# EAGLE design STM32F4 TFT-Proto Adapter FSMC Vertical (EAGLE 6.4)
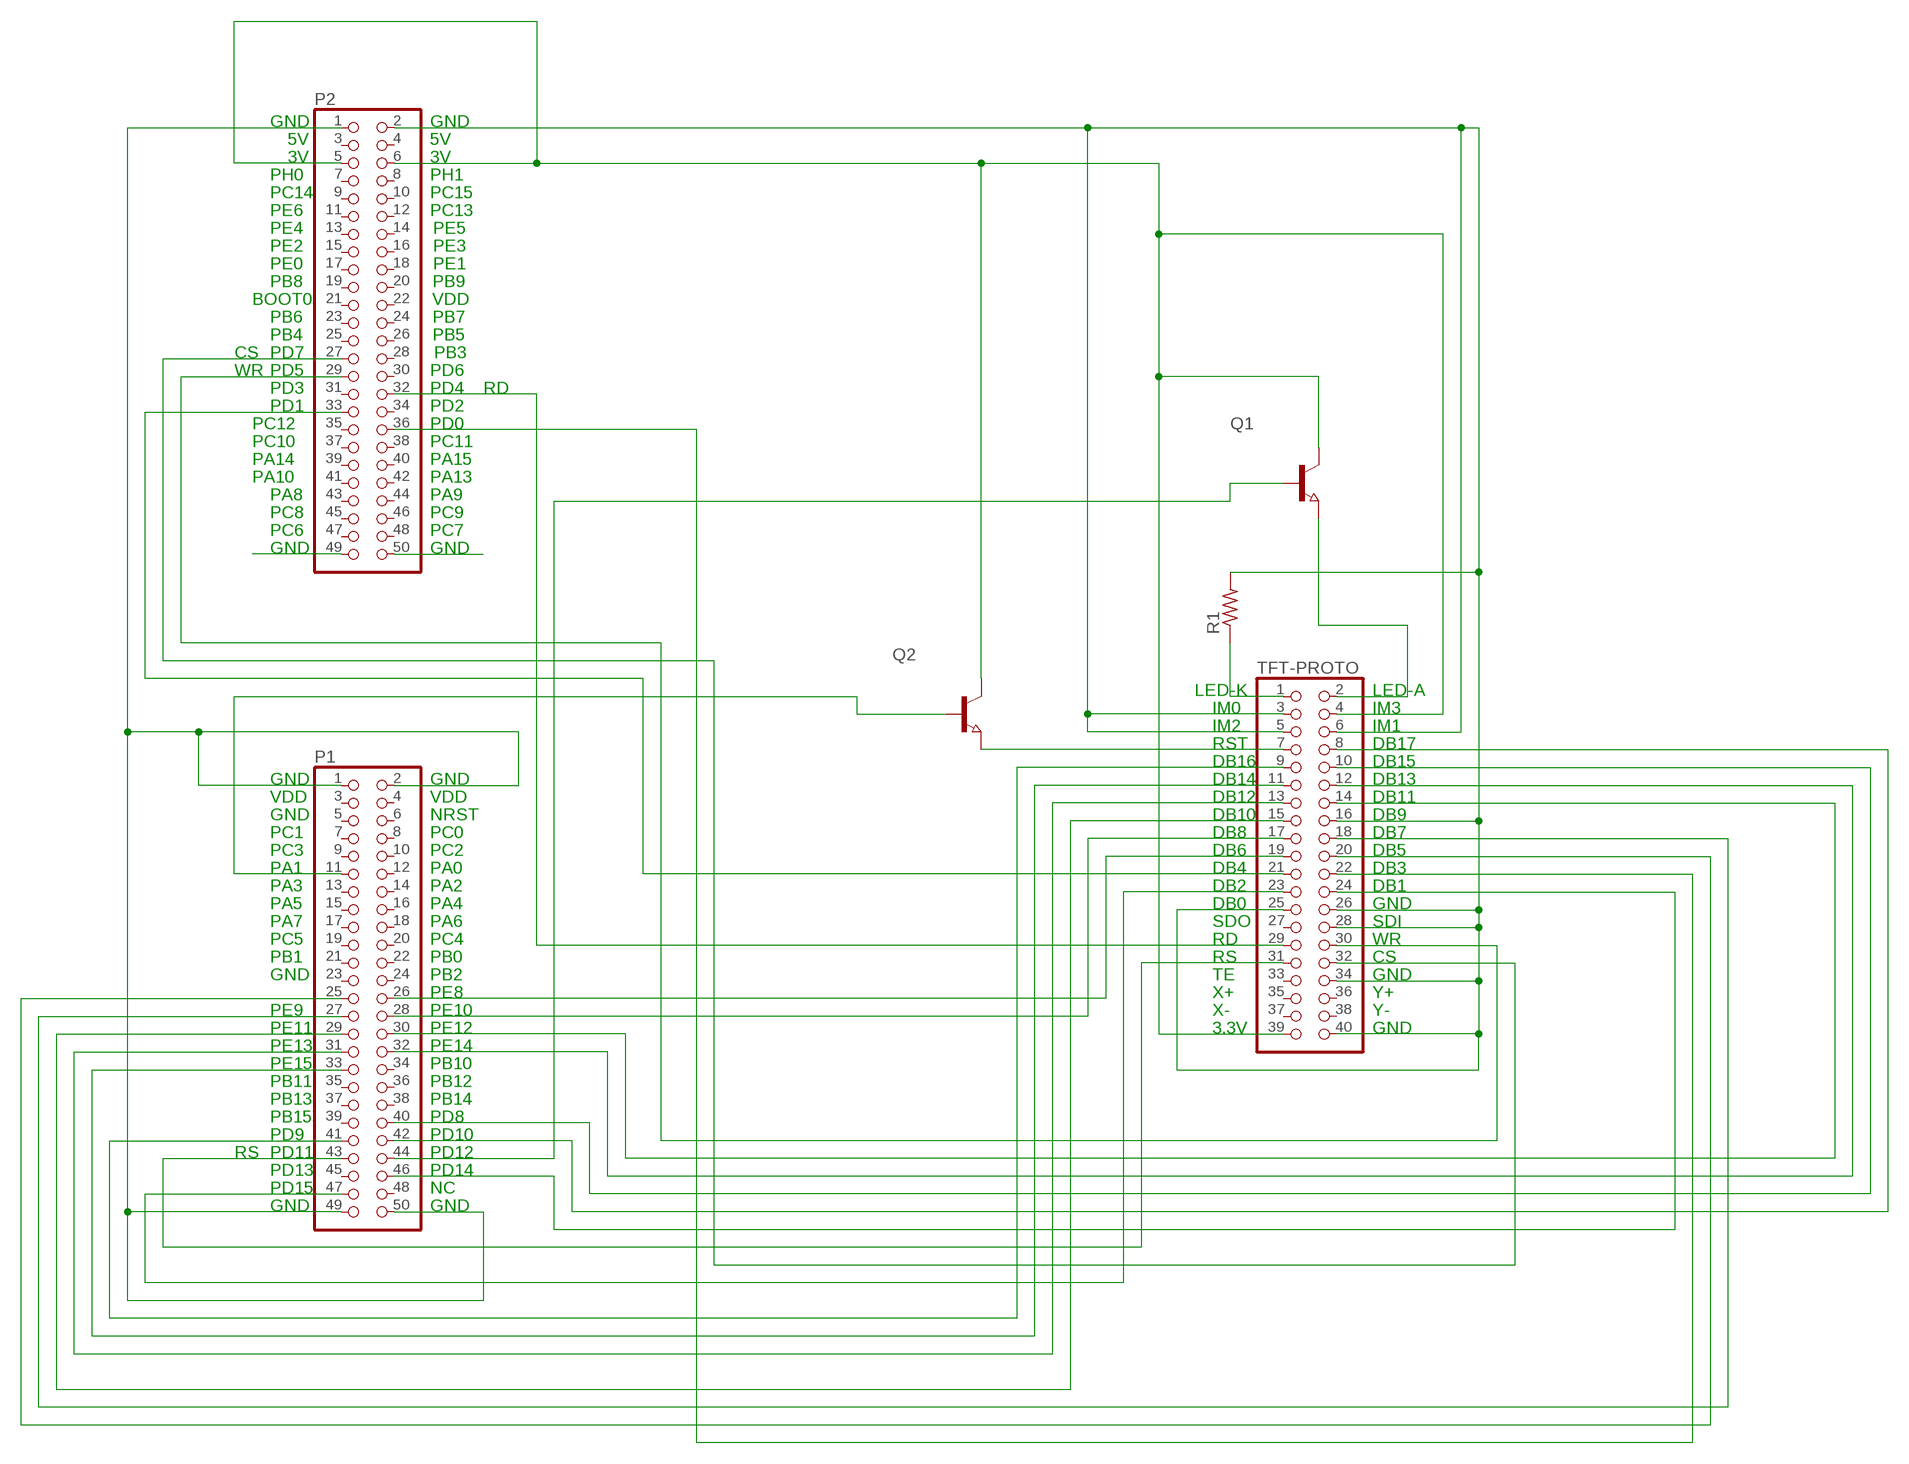
[diagram p0: schematic, sheet 1]

## Parts
P1  PINHD-2X25  [2X25]
P2  PINHD-2X25  [2X25]
Q1  NPN-TRANSISTOR_SOT23  [SOT23]
Q2  NPN-TRANSISTOR_SOT23  [SOT23]
R1  R-US_R0805  [R0805]
TFT-PROTO  PINHD-2X20  [2X20]

## Nets
CS: P2.27 TFT-PROTO.32
DB1: P1.46 TFT-PROTO.24
DB2: P1.47 TFT-PROTO.23
DB3: P2.36 TFT-PROTO.22
DB4: P2.33 TFT-PROTO.21
DB5: P1.25 TFT-PROTO.20
DB6: P1.26 TFT-PROTO.19
DB7: P1.27 TFT-PROTO.18
DB8: P1.28 TFT-PROTO.17
DB10: P1.29 TFT-PROTO.15
DB11: P1.30 TFT-PROTO.14
DB12: P1.31 TFT-PROTO.13
DB13: P1.32 TFT-PROTO.12
DB14: P1.33 TFT-PROTO.11
DB15: P1.40 TFT-PROTO.10
DB16: P1.41 TFT-PROTO.9
DB17: P1.42 TFT-PROTO.8
GND: P1.1 P1.2 P1.49 P1.50 P2.1 P2.2 P2.49 P2.50 R1.2 TFT-PROTO.3 TFT-PROTO.5 TFT-PROTO.6 TFT-PROTO.16 TFT-PROTO.25 TFT-PROTO.26 TFT-PROTO.28 TFT-PROTO.34 TFT-PROTO.40
N$1: P1.44 Q1.1(B)
N$3: R1.1 TFT-PROTO.1
N$4: Q1.2(E) TFT-PROTO.2
N$26: Q2.2(E) TFT-PROTO.7
PWR: P2.5 P2.6 Q1.3(C) Q2.3(C) TFT-PROTO.4 TFT-PROTO.39
RD: P2.32 TFT-PROTO.29
RS: P1.43 TFT-PROTO.31
RST: P1.11 Q2.1(B)
WR: P2.29 TFT-PROTO.30
Unconnected: P1.3 P1.4 P1.5 P1.6 P1.7 P1.8 P1.9 P1.10 P1.12 P1.13 P1.14 P1.15 P1.16 P1.17 P1.18 P1.19 P1.20 P1.21 P1.22 P1.23 P1.24 P1.34 P1.35 P1.36 P1.37 P1.38 P1.39 P1.45 P1.48 P2.3 P2.4 P2.7 P2.8 P2.9 P2.10 P2.11 P2.12 P2.13 P2.14 P2.15 P2.16 P2.17 P2.18 P2.19 P2.20 P2.21 P2.22 P2.23 P2.24 P2.25 P2.26 P2.28 P2.30 P2.31 P2.34 P2.35 P2.37 P2.38 P2.39 P2.40 P2.41 P2.42 P2.43 P2.44 P2.45 P2.46 P2.47 P2.48 TFT-PROTO.27 TFT-PROTO.33 TFT-PROTO.35 TFT-PROTO.36 TFT-PROTO.37 TFT-PROTO.38

## Notes on the sheet
- GND | GND
- 5V | 5V
- 3V | 3V
- PH0 | PH1
- PC14 | PC15
- PE6 | PC13
- PE4                          PE5
- PE2                          PE3
- PE0                          PE1
- PB8                          PB9
- BOOT0                        VDD
- PB6                          PB7
- PB4                          PB5
- CS | PD7                          PB3
- WR | PD5 | PD6
- PD3 | PD4 | RD
- PD1 | PD2
- PC12 | PD0
- PC10 | PC11
- PA14 | PA15
- PA10 | PA13
- PA8 | PA9
- PC8 | PC9
- PC6 | PC7
- GND | GND
- LED-K | LED-A
- IM0 | IM3
- IM2 | IM1
- RST | DB17
- DB16 | DB15
- GND | GND | DB14 | DB13
- VDD | VDD | DB12 | DB11
- GND | NRST | DB10 | DB9
- PC1 | PC0 | DB8 | DB7
- PC3 | PC2 | DB6 | DB5
- PA1 | PA0 | DB4 | DB3
- PA3 | PA2 | DB2 | DB1
- PA5 | PA4 | DB0 | GND
- PA7 | PA6 | SDO | SDI
- PC5 | PC4 | RD | WR
- PB1 | PB0 | RS | CS
- GND | PB2 | TE | GND
- PE7 | PE8 | X+ | Y+
- PE9 | PE10 | X- | Y-
- PE11 | PE12 | 3.3V | GND
- PE13 | PE14
- PE15 | PB10
- PB11 | PB12
- PB13 | PB14
- PB15 | PD8
- PD9 | PD10
- RS | PD11 | PD12
- PD13 | PD14
- PD15 | NC
- GND | GND

## Library data of the parts
P1 P2 = pinhead:PINHD-2X25: PIN HEADER
Q1 Q2 = semicon-smd-ipc:NPN-TRANSISTOR_: NPN TRANSISTOR
R1 = resistor:R-US_: RESISTOR, American symbol
TFT-PROTO = pinhead:PINHD-2X20: PIN HEADER

## Board
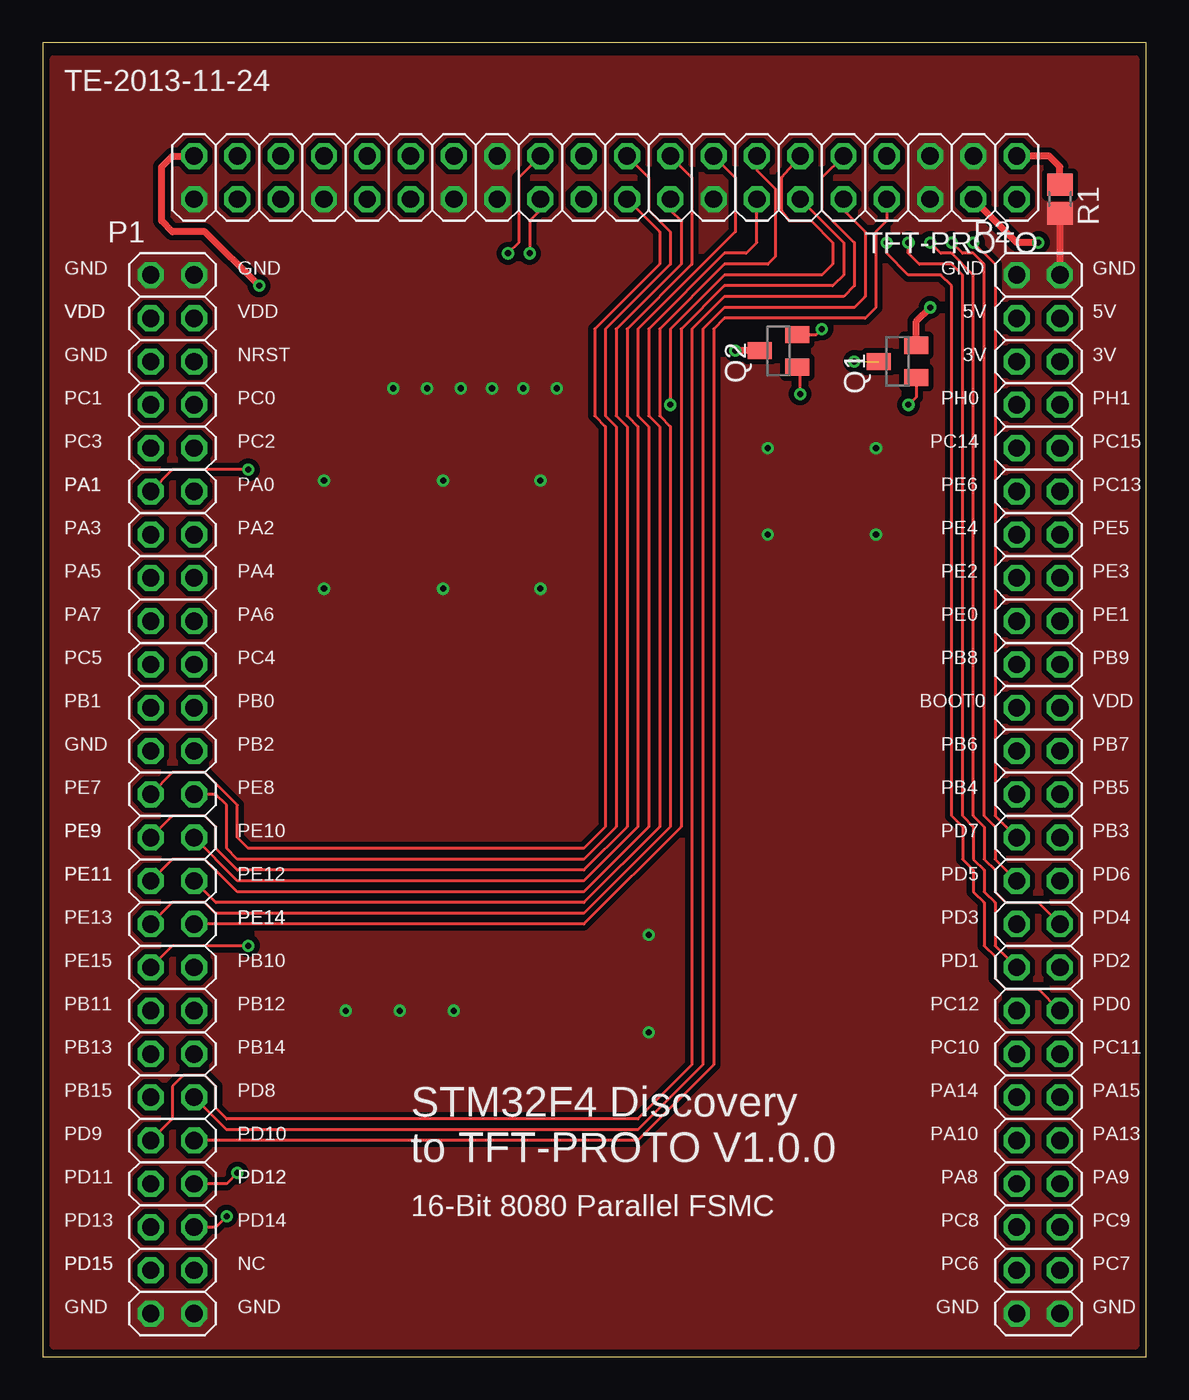
[diagram p1: board, top side]
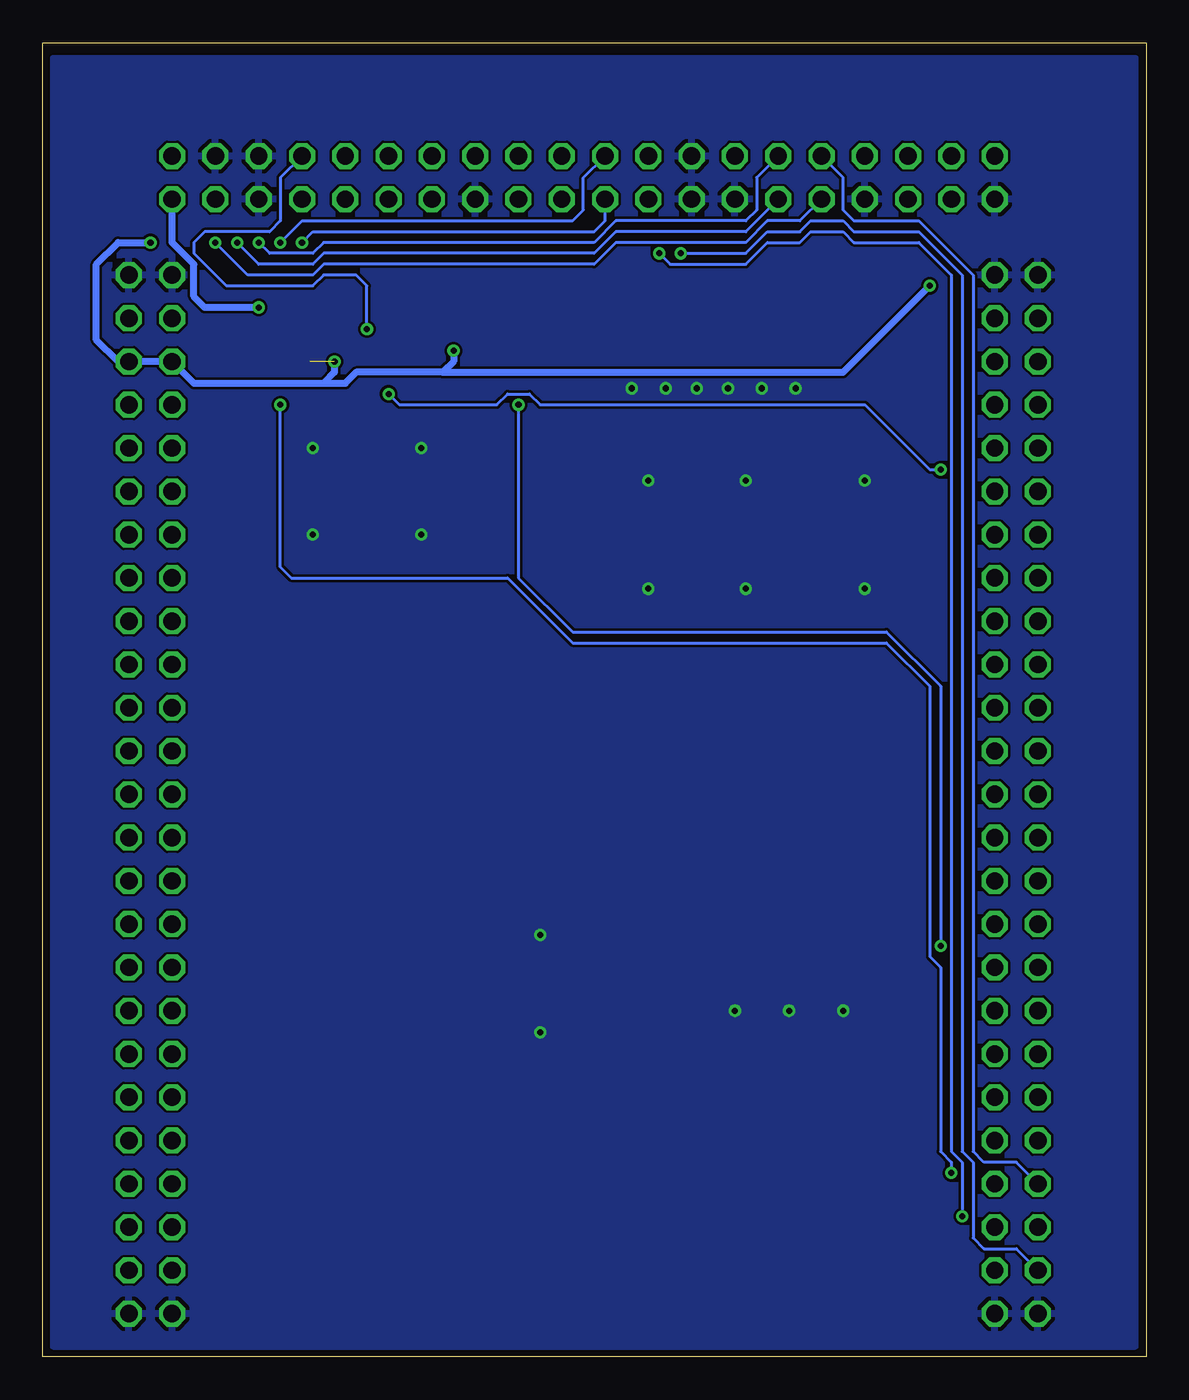
[diagram p2: board, bottom side, seen from below]

Size 64.75 x 77.14 mm. Coordinates in mm from the lower left corner, seen from the top.
Outline: 0,0 64.75,0 64.75,77.14 0,77.14 0,0
Copper layers (1*16): Top 0.0356mm / dielectric 1.5011mm / Bottom 0.0356mm
Design rules "LaenPCBOrder *": minimum track width 6mil, minimum drill 13mil, track to track 6mil, track to pad 6mil, pad to pad 6mil, via to via 6mil, smd to smd 6mil, copper to edge 15mil, drill to drill 6mil, minimum pad ring 7mil, minimum via ring 7mil, stop-mask expansion 4mil, vias tented up to drill 25mil, thermal gap 10mil

### Footprints (pad centres in the part's own frame; a part is rotated, then mirrored left to right if it is on the bottom)
2X25 = drill 1.016 octagon: 1 -30.48,-1.27; 2 -30.48,1.27; 3 -27.94,-1.27; 4 -27.94,1.27; 5 -25.4,-1.27; 6 -25.4,1.27; 7 -22.86,-1.27; 8 -22.86,1.27; 9 -20.32,-1.27; 10 -20.32,1.27; 11 -17.78,-1.27; 12 -17.78,1.27; 13 -15.24,-1.27; 14 -15.24,1.27; 15 -12.7,-1.27; 16 -12.7,1.27; 17 -10.16,-1.27; 18 -10.16,1.27; 19 -7.62,-1.27; 20 -7.62,1.27; 21 -5.08,-1.27; 22 -5.08,1.27; 23 -2.54,-1.27; 24 -2.54,1.27; 25 0,-1.27; 26 0,1.27; 27 2.54,-1.27; 28 2.54,1.27; 29 5.08,-1.27; 30 5.08,1.27; 31 7.62,-1.27; 32 7.62,1.27; 33 10.16,-1.27; 34 10.16,1.27; 35 12.7,-1.27; 36 12.7,1.27; 37 15.24,-1.27; 38 15.24,1.27; 39 17.78,-1.27; 40 17.78,1.27; 41 20.32,-1.27; 42 20.32,1.27; 43 22.86,-1.27; 44 22.86,1.27; 45 25.4,-1.27; 46 25.4,1.27; 47 27.94,-1.27; 48 27.94,1.27; 49 30.48,-1.27; 50 30.48,1.27
SOT23 = smd 1 x 1.4: 1 -0.95,-1.1; 2 0.95,-1.1; 3 0,1.1
R0805 = smd 1.3 x 1.5: 1 -0.85,0; 2 0.85,0
2X20 = drill 1.016 octagon: 1 -24.13,-1.27; 2 -24.13,1.27; 3 -21.59,-1.27; 4 -21.59,1.27; 5 -19.05,-1.27; 6 -19.05,1.27; 7 -16.51,-1.27; 8 -16.51,1.27; 9 -13.97,-1.27; 10 -13.97,1.27; 11 -11.43,-1.27; 12 -11.43,1.27; 13 -8.89,-1.27; 14 -8.89,1.27; 15 -6.35,-1.27; 16 -6.35,1.27; 17 -3.81,-1.27; 18 -3.81,1.27; 19 -1.27,-1.27; 20 -1.27,1.27; 21 1.27,-1.27; 22 1.27,1.27; 23 3.81,-1.27; 24 3.81,1.27; 25 6.35,-1.27; 26 6.35,1.27; 27 8.89,-1.27; 28 8.89,1.27; 29 11.43,-1.27; 30 11.43,1.27; 31 13.97,-1.27; 32 13.97,1.27; 33 16.51,-1.27; 34 16.51,1.27; 35 19.05,-1.27; 36 19.05,1.27; 37 21.59,-1.27; 38 21.59,1.27; 39 24.13,-1.27; 40 24.13,1.27

### Placement (x,y rotation side)
P1  7.62,33.02 270 top
P2  58.42,33.02 270 top
Q1  50.16,58.42 90 top
Q2  43.18,59.05 90 top
R1  59.69,67.94 270 top
TFT-PROTO  33.02,69.22 180 top

### Tracks (layer width: path | path; a pad name or v marks a point on that pad's centre or on a via)
CS  (via drill 0.36)
  Top 0.178: P2.27 55.88,31.75 55.88,64.14 v54.61,65.41
  Bottom 0.178: TFT-PROTO.32 20.32,66.67 22.22,66.67 23.49,65.41 31.11,65.41 32.38,64.14 48.26,64.14 48.9,63.5 52.71,63.5 v54.61,65.41
DB1  (via drill 0.36)
  Top 0.178: TFT-PROTO.24 29.21,67.31 28.57,66.67 v28.57,64.77 | v10.79,8.26 10.16,7.62 P1.46
  Bottom 0.178: v28.57,64.77 27.94,64.14 23.49,64.14 22.22,65.41 20.32,65.41 19.68,66.04 17.78,66.04 17.14,65.41 13.34,65.41 11.43,63.5 11.43,12.06 10.79,11.43 v10.79,8.26
DB2  (via drill 0.36)
  Top 0.178: TFT-PROTO.23 27.94,69.22 27.94,65.41 v27.3,64.77
  Bottom 0.178: v27.3,64.77 23.49,64.77 22.22,66.04 20.32,66.04 19.68,66.67 17.78,66.67 17.14,66.04 13.34,66.04 10.79,63.5 10.79,12.06 10.16,11.43 10.16,6.99 9.53,6.35 7.62,6.35 P1.47
DB3  (via drill 0.36)
  Top 0.178: P2.36 58.42,21.59 56.52,21.59 55.88,22.23 55.88,23.5 55.25,24.13 55.25,26.67 54.61,27.3 54.61,28.57 53.98,29.21 53.98,31.11 53.34,31.75 53.34,62.87 52.71,63.5 50.8,63.5 49.53,64.77 v49.53,65.41
  Bottom 0.178: v49.53,65.41 48.9,66.04 32.38,66.04 31.75,66.67 TFT-PROTO.22
DB4  (via drill 0.36)
  Top 0.178: P2.33 55.88,24.13 55.88,26.67 55.25,27.3 55.25,28.57 54.61,29.21 54.61,31.11 53.98,31.75 53.98,63.5 53.34,64.14 51.44,64.14 50.8,64.77 v50.8,65.41
  Bottom 0.178: v50.8,65.41 49.53,66.67 33.66,66.67 33.02,67.31 33.02,69.22 TFT-PROTO.21
DB5
  Top 0.178: TFT-PROTO.20 36.2,66.04 36.2,64.14 32.38,60.33 32.38,55.24 33.02,54.61 33.02,31.11 31.75,29.84 12.07,29.84 11.43,30.48 11.43,32.38 9.53,34.29 7.62,34.29 P1.25
DB6
  Top 0.178: TFT-PROTO.19 35.56,69.22 35.56,67.31 36.83,66.04 36.83,64.14 33.02,60.33 33.02,55.24 33.66,54.61 33.66,31.11 31.75,29.21 11.43,29.21 10.79,29.84 10.79,32.38 10.16,33.02 P1.26
DB7
  Top 0.178: TFT-PROTO.18 36.83,67.31 37.47,66.67 37.47,64.14 33.66,60.33 33.66,55.24 34.29,54.61 34.29,31.11 31.75,28.57 11.43,28.57 10.16,29.84 10.16,31.11 9.53,31.75 7.62,31.75 P1.27
DB8
  Top 0.178: TFT-PROTO.17 38.1,69.22 38.1,64.14 34.29,60.33 34.29,55.24 34.92,54.61 34.92,31.11 31.75,27.94 11.43,27.94 P1.28
DB10
  Top 0.178: TFT-PROTO.15 40.64,69.22 40.64,66.04 34.92,60.33 34.92,55.24 35.56,54.61 35.56,31.11 31.75,27.3 11.43,27.3 9.53,29.21 7.62,29.21 P1.29
DB11
  Top 0.178: P1.30 10.16,26.67 31.75,26.67 36.2,31.11 36.2,54.61 35.56,55.24 35.56,60.33 40.01,64.77 41.28,64.77 41.91,65.41 TFT-PROTO.14
DB12
  Top 0.178: TFT-PROTO.13 41.91,69.65 42.98,68.58 42.98,64.57 42.55,64.14 40.01,64.14 36.2,60.33 36.2,55.24 36.83,54.61 36.83,31.11 31.75,26.04 10.16,26.04 9.53,26.67 7.62,26.67 P1.31
DB13
  Top 0.178: TFT-PROTO.12 46.99,65.41 46.99,63.5 46.36,62.87 40.01,62.87 37.47,60.33 37.47,31.11 31.75,25.4 P1.32
DB14  (via drill 0.36)
  Top 0.178: TFT-PROTO.11 43.33,69.22 43.33,67.31 43.82,66.67 45.09,66.67 46.36,65.41 46.36,64.14 45.72,63.5 40.01,63.5 36.83,60.33 v36.83,55.88 | v12.07,24.13 7.62,24.13 P1.33
  Bottom 0.178: v36.83,55.88 36.83,45.72 33.66,42.55 15.24,42.55 12.07,39.37 v12.07,24.13
DB15
  Top 0.178: TFT-PROTO.10 46.99,67.31 48.26,66.04 48.26,62.23 47.62,61.59 40.01,61.59 38.73,60.33 38.73,17.14 34.92,13.34 10.79,13.34 P1.40
DB16
  Top 0.178: TFT-PROTO.9 45.72,69.22 45.72,67.31 47.62,65.41 47.62,62.87 46.99,62.23 40.01,62.23 38.1,60.33 38.1,17.14 34.92,13.97 10.79,13.97 10.16,14.61 10.16,15.88 9.53,16.51 8.26,16.51 7.62,15.88 7.62,13.97 P1.41
DB17
  Top 0.178: TFT-PROTO.8 49.53,66.67 48.9,66.04 48.9,61.59 48.26,60.96 40.01,60.96 39.37,60.33 39.37,17.14 34.92,12.7 P1.42
GND  (via drill 0.36)
  Top 0.406: R1.2 P2.2
  other vias: 17.78,20.32 20.95,20.32 24.13,20.32 20.57,56.85 22.56,56.85 24.54,56.85 26.37,56.85 28.19,56.85 30.18,56.85 42.55,53.34 48.9,53.34 42.55,48.26 48.9,48.26 16.51,51.44 23.49,51.44 29.21,51.44 29.21,45.09 23.49,45.09 16.51,45.09 35.56,24.77 35.56,19.05
  pour Bottom: 0.64,76.2 64.14,76.2 64.14,0.64 0.64,0.64
  pour Top (isolate 0.305, no thermals): 0.64,76.2 64.14,76.2 64.14,0.64 0.64,0.64
N$1  (via drill 0.36)
  Top 0.178: v11.43,10.79 10.79,10.16 P1.44 | Q1.1 51.27,56.34 v50.8,55.88
  Bottom 0.178: v11.43,10.79 11.43,11.43 12.07,12.06 12.07,22.86 12.7,23.5 12.7,39.37 15.24,41.91 33.66,41.91 37.47,45.72 50.16,45.72 50.8,46.35 v50.8,55.88
N$3
  Top 0.406: R1.1 59.69,69.85 59.05,70.48 TFT-PROTO.1
N$4  (via drill 0.36)
  Top 0.406: Q1.2 51.27,60.79 v52.07,61.59
  Bottom 0.406: v52.07,61.59 55.25,61.59 55.88,62.23 55.88,64.14 57.15,65.41 TFT-PROTO.2
N$26  (via drill 0.36)
  Top 0.178: Q2.2 45.4,60.01 v45.72,60.33
  Bottom 0.178: v45.72,60.33 45.72,62.87 46.36,63.5 48.26,63.5 48.9,62.87 53.98,62.87 55.88,64.77 55.88,65.41 55.25,66.04 51.44,66.04 50.8,66.67 50.8,69.22 TFT-PROTO.7
PWR  (via drill 0.36)  (1 unrouted)
  Top 0.406: Q2.3 v40.64,59.05 | v58.42,65.41 57.15,65.41 TFT-PROTO.4 | v12.7,62.87 9.53,66.04 7.62,66.04 6.98,66.67 6.98,69.85 7.62,70.48 TFT-PROTO.39
  Bottom 0.406: v40.64,59.05 40.64,58.42 41.28,57.78 | 41.28,57.78 46.36,57.78 46.99,57.15 48.26,57.15 | 41.28,57.78 17.78,57.78 v12.7,62.87 | P2.5 P2.6 | P2.5 60.33,58.42 61.59,59.69 61.59,64.14 60.33,65.41 v58.42,65.41 | P2.5 55.88,57.15 48.26,57.15 | v47.62,58.42 47.62,57.78 48.26,57.15
RD  (via drill 0.36)
  Top 0.178: P2.32 58.42,26.67 56.52,26.67 55.88,27.3 55.88,28.57 55.25,29.21 55.25,31.11 54.61,31.75 54.61,63.5 53.34,64.77 52.71,64.77 v52.07,65.41
  Bottom 0.178: TFT-PROTO.29 22.86,69.22 22.86,67.31 23.49,66.67 31.11,66.67 32.38,65.41 48.26,65.41 48.9,64.77 51.44,64.77 v52.07,65.41
RS
  Bottom 0.178: P1.43 7.62,11.43 9.53,11.43 10.16,12.06 10.16,63.5 13.34,66.67 17.14,66.67 17.78,67.31 17.78,69.22 TFT-PROTO.31
RST  (via drill 0.36)
  Top 0.178: v44.45,56.52 44.45,57.94 Q2.1 | v12.07,52.07 7.62,52.07 P1.11
  Bottom 0.178: v44.45,56.52 43.82,55.88 38.1,55.88 37.47,56.52 36.2,56.52 35.56,55.88 16.51,55.88 12.7,52.07 v12.07,52.07
WR  (via drill 0.36)
  Top 0.178: P2.29 55.88,29.21 55.88,31.11 55.25,31.75 55.25,64.14 54.61,64.77 53.98,64.77 v53.34,65.41
  Bottom 0.178: TFT-PROTO.30 23.49,66.04 31.11,66.04 32.38,64.77 48.26,64.77 48.9,64.14 52.07,64.14 v53.34,65.41

### Text on the board
tNames: TE-2013-11-24 | GND | GND | GND | GND | VDD | VDD | VDD | 5V | 5V | GND | NRST | 3V | 3V | PC1 | PC0 | PH0 | PH1 | PC3 | PC2 | PC14 | PC15 | PA1 | PA1 | PA0 | PE6 | PC13 | PA3 | PA2 | PE4 | PE5 | PA5 | PA4 | PE2 | PE3 | PA7 | PA6 | PE0 | PE1 | PC5 | PC4 | PB8 | PB9 | PB1 | PB0 | BOOT0 | VDD | GND | PB2 | PB6 | PB7 | PE7 | PE8 | PB4 | PB5 | PE9 | PE9 | PE10 | PD7 | PB3 | PE11 | PE11 | PE12 | PD5 | PD6 | PE13 | PE14 | PE14 | PD3 | PD4 | PE15 | PB10 | PD1 | PD2 | PB11 | PB12 | PC12 | PD0 | PB13 | PB14 | PC10 | PC11 | PB15 | PD8 | PA14 | PA15 | PD9 | PD10 | PA10 | PA13 | STM32F4 Discovery / to TFT-PROTO V1.0.0 | PD11 | PD12 | PD12 | PA8 | PA9 | PD13 | PD14 | 16-Bit 8080 Parallel FSMC | PC8 | PC9 | PD15 | PD15 | NC | PC6 | PC7 | GND | GND | GND | GND